# Altium schematic sheet 电源板.SchDoc
size A4
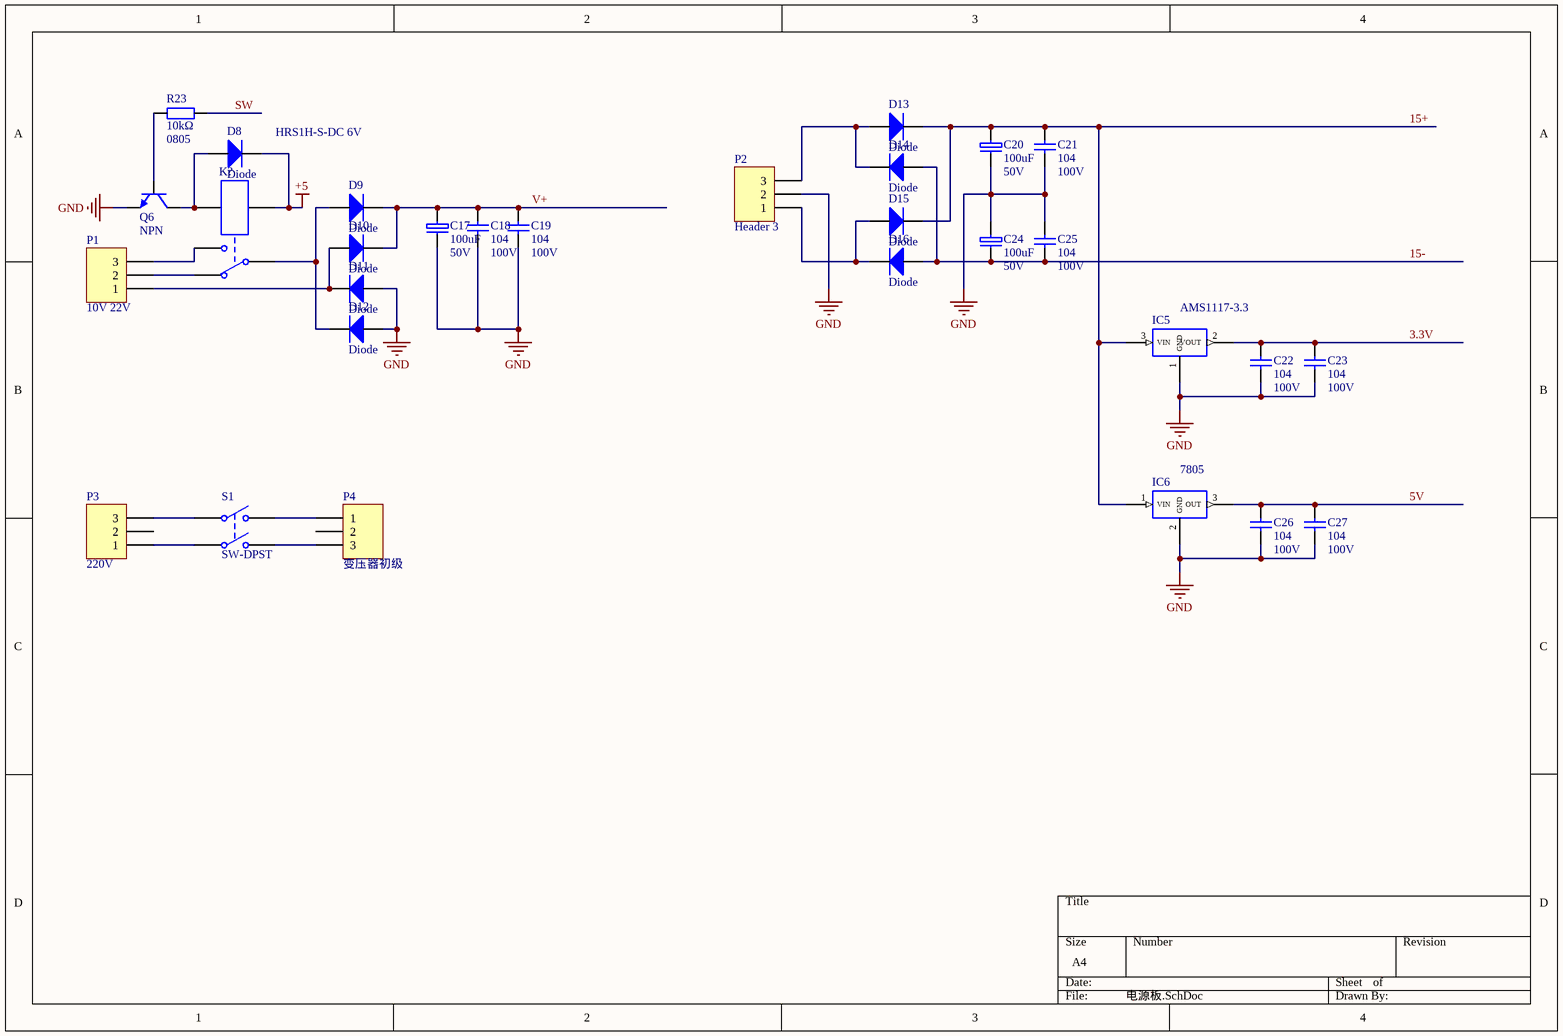
[diagram p0: 电源板.SchDoc]

## Parts
C17  100uF  value 50V  [50v 1000uf]
C18  104  value 100V  [C0201]
C19  104  value 100V  [C0201]
C20  100uF  value 50V  [50v 1000uf]
C21  104  value 100V  [C0201]
C22  104  value 100V  [C0201]
C23  104  value 100V  [C0201]
C24  100uF  value 50V  [50v 1000uf]
C25  104  value 100V  [C0201]
C26  104  value 100V  [C0201]
C27  104  value 100V  [C0201]
D8  Diode  [1N4148类]
D9  Diode  [1N4148类]
D10  Diode  [1N4148类]
D11  Diode  [1N4148类]
D12  Diode  [1N4148类]
D13  Diode  [1N4148类]
D14  Diode  [1N4148类]
D15  Diode  [1N4148类]
D16  Diode  [1N4148类]
IC5  AMS1117-3.3  [SOT-223]
IC6  7805  [SOT-223]
K?  HRS1H-S-DC 6V  [继电器]
P1  10V 22V  [HDR1X3]
P2  Header 3  [HDR1X3]
P3  220V  [HDR1X3]
P4  变压器初级  [HDR1X3]
Q6  NPN  [SOT-23]
R23  10kΩ  value 0805  [R0603]
S1  SW-DPST  [DPST-4]

## Nets
+5: D8.2(K) K?.2
GND: C17.2(-) C18.1 C19.1 C20.2(-) C21.1 C22.1 C23.1 C24.1(+) C25.2 C26.1 C27.1 D11.1(A) D12.1(A) IC5.1(GND) IC6.2(GND) P2.2 Q6.3(E)
3.3V: C22.2 C23.2 IC5.2(VOUT)
5V: C26.2 C27.2 IC6.3(OUT)
15+: C20.1(+) C21.2 D13.2(K) D15.2(K) IC5.3(VIN) IC6.1(VIN)
15-: C24.2(-) C25.1 D14.1(A) D16.1(A)
SW: R23.2
V+: C17.1(+) C18.2 C19.2 D9.2(K) D10.2(K)
NetD8_1: D8.1(A) K?.5 Q6.1(C)
NetD9_1: D9.1(A) D12.2(K) K?.4
NetD10_1: D10.1(A) D11.2(K) P1.1
NetD13_1: D13.1(A) D14.2(K) P2.3
NetD15_1: D15.1(A) D16.2(K) P2.1
NetK?_1: K?.1 P1.2
NetK?_6: K?.6 P1.3
NetP3_1: P3.1 S1.3(COMMON2)
NetP3_3: P3.3 S1.1(COMMON1)
NetP4_1: P4.1 S1.2(NO1)
NetP4_3: P4.3 S1.4(NO2)
NetQ6_2: Q6.2(B) R23.1

Not connected (* = marked no-connect by the designer): P3 2; P4 2

## Library data of the parts
C17 C20 C24 = 100uF: 有极性电容
C18 C19 C21-C23 C25-C27 = 104: 无极性电容
D8-D16 = Diode: 二极管
IC5 IC6 = AMS1117-3.3: LDO
K? = HRS1H-S-DC 6V: 继电器
P1 = Header 3: LatestRevisionDate: 17-Jul-2002; LatestRevisionNote: Re-released for DXP Platform.; Publisher: Altium Limited
P2-P4 = Header 3: Header, 3-Pin; LatestRevisionDate: 17-Jul-2002; LatestRevisionNote: Re-released for DXP Platform.; Publisher: Altium Limited
Q6 = NPN: 三极管
R23 = 10kΩ: 贴片/直插电阻
S1 = SW-DPST: Double-Pole, Single-Throw Switch; Published: 24-Mar-1999; LatestRevisionDate: 17-Jul-2002; LatestRevisionNote: Re-released for DXP Platform.; PackageReference: DPST-4; Publisher: Altium Limited; PackageDescription: Switch; 4 Leads